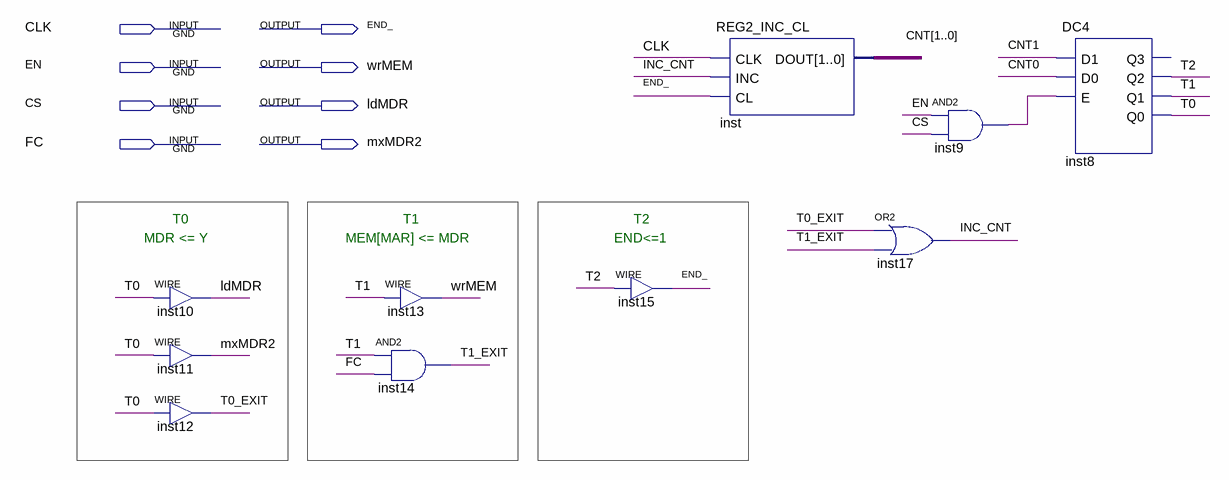
[diagram p0: schematic sheet]
// Quartus schematic STX.bdf as structural Verilog: 10 symbols, 8 pins
module STX (
  input  CLK,
  input  EN,
  input  CS,
  input  FC,
  output END_,
  output wrMEM,
  output ldMDR,
  output mxMDR2
);

  wire INC_CNT, inst9_out, T0, T0_EXIT, T1, T1_EXIT, T2;
  wire [1:0] CNT;

  assign ldMDR = T0;  // WIRE inst10
  assign mxMDR2 = T0;  // WIRE inst11
  assign T0_EXIT = T0;  // WIRE inst12
  assign wrMEM = T1;  // WIRE inst13
  and inst14 (T1_EXIT, T1, FC);
  assign END_ = T2;  // WIRE inst15
  REG2_INC_CL inst (.CLK(CLK), .INC(INC_CNT), .CL(END_), .DOUT(CNT));
  and inst9 (inst9_out, EN, CS);
  or inst17 (INC_CNT, T0_EXIT, T1_EXIT);
  DC4 inst8 (.D1(CNT[1]), .D0(CNT[0]), .E(inst9_out), .Q2(T2), .Q1(T1), .Q0(T0));  // open: Q3

  // Notes on the sheet:
  //   T0
  //   T1
  //   T2
  //   MDR <= Y
  //   MEM[MAR] <= MDR
  //   END<=1
endmodule
